# EAGLE design chibarobo2024 (EAGLE 9.6.2)

## Sheet 1 of 2
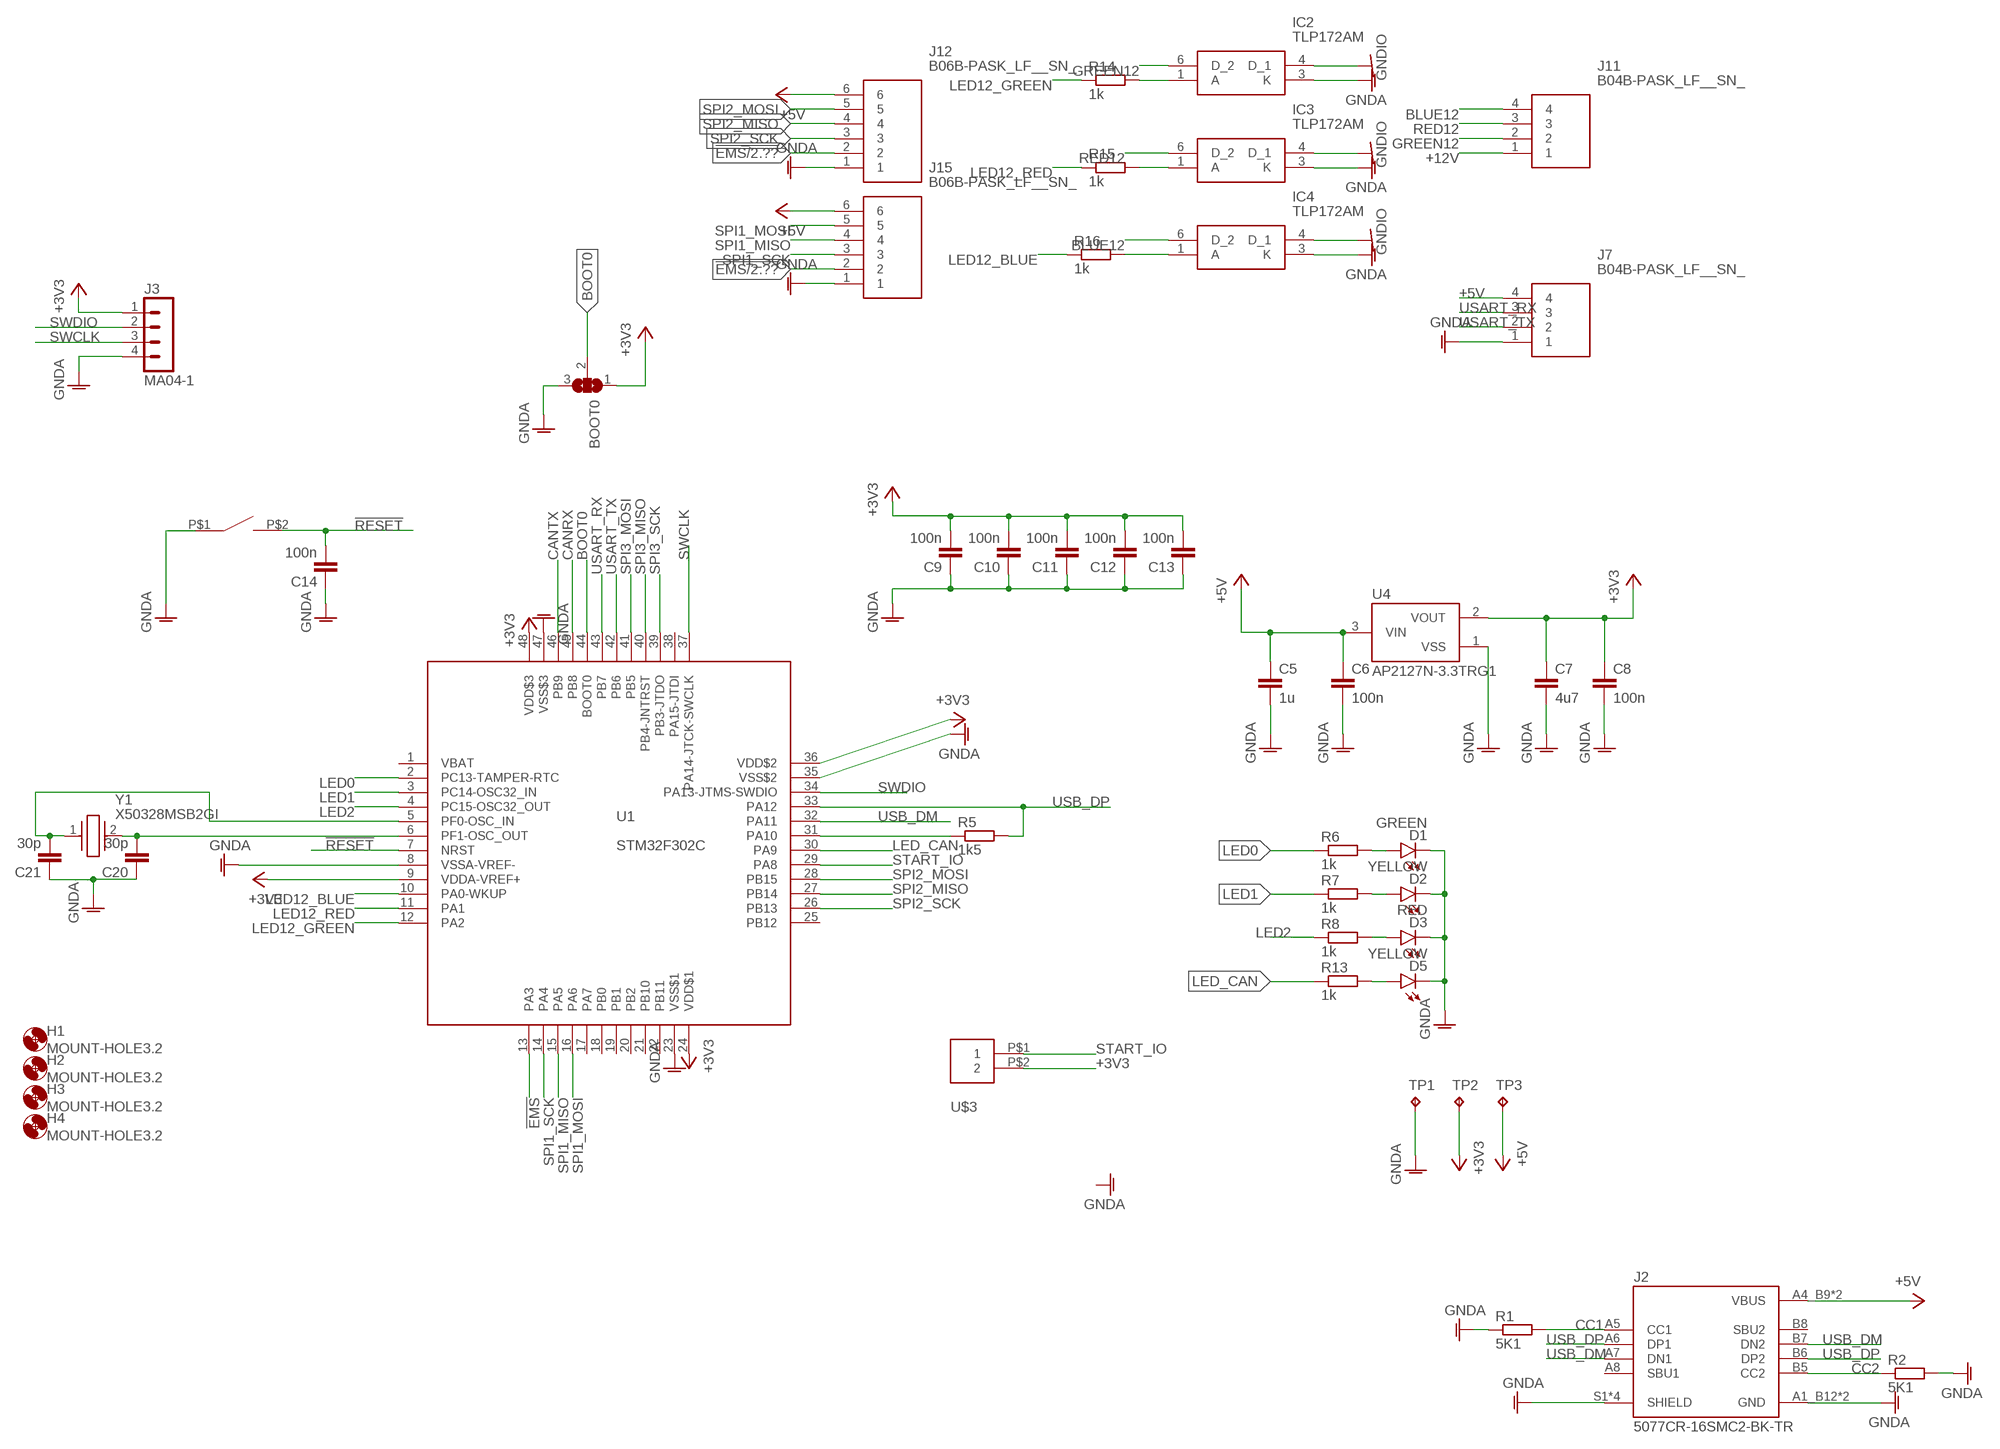
[diagram p0: schematic, sheet 1]

### Parts
BOOT0  SJ2W  [SJ_2]
C5  1u  C-EUC0603  [C0603]
C6  100n  C-EUC0603  [C0603]
C7  4u7  C-EUC0805  [C0805]
C8  100n  C-EUC0603  [C0603]
C9  100n  C-EUC0603  [C0603]
C10  100n  C-EUC0603  [C0603]
C11  100n  C-EUC0603  [C0603]
C12  100n  C-EUC0603  [C0603]
C13  100n  C-EUC0603  [C0603]
C14  100n  C-EUC0603  [C0603]
C20  30p  C-EUC0603  [C0603]
C21  30p  C-EUC0603  [C0603]
D1  GREEN  LEDCHIPLED_0805  [CHIPLED_0805]
D2  YELLOW  LEDCHIPLED_0805  [CHIPLED_0805]
D3  RED  LEDCHIPLED_0805  [CHIPLED_0805]
D5  YELLOW  LEDCHIPLED_0805  [CHIPLED_0805]
H1  MOUNT-HOLE3.2  [3,2]
H2  MOUNT-HOLE3.2  [3,2]
H3  MOUNT-HOLE3.2  [3,2]
H4  MOUNT-HOLE3.2  [3,2]
IC2  TLP172AM  [11-4M1S]
IC3  TLP172AM  [11-4M1S]
IC4  TLP172AM  [11-4M1S]
J2  5077CR-16SMC2-BK-TR  [NELTRON_5077CR-16SMC2-BK-TR]
J3  MA04-1  [MA04-1]
J7  B04B-PASK_LF__SN_  [B04BPASKLFSN]
J11  B04B-PASK_LF__SN_  [B04BPASKLFSN]
J12  B06B-PASK_LF__SN_  [B06BPASKLFSN]
J15  B06B-PASK_LF__SN_  [B06BPASKLFSN]
R1  5K1  R-EU_R0603  [R0603]
R2  5K1  R-EU_R0603  [R0603]
R5  1k5  R-EU_R0603  [R0603]
R6  1k  R-EU_R0603  [R0603]
R7  1k  R-EU_R0603  [R0603]
R8  1k  R-EU_R0603  [R0603]
R13  1k  R-EU_R0603  [R0603]
R14  1k  R-EU_R0603  [R0603]
R15  1k  R-EU_R0603  [R0603]
R16  1k  R-EU_R0603  [R0603]
S1  SWITCH_TACTILETOP  [SWITCH_TACTILE_3X6]
TP1  TPB1,27  [B1,27]
TP2  TPB1,27  [B1,27]
TP3  TPB1,27  [B1,27]
U1  STM32F302C  STM32F303C  [LQFP48]
U4  AP2127N-3.3TRG1  XC6206  [SOT95P240X110-3]
U$3  XH-2-STRAIGHT  [CON-XH-2-STRAIGHT]
Y1  X50328MSB2GI  [RESC5032X135N]

### Nets
!EMS: J12.2 J15.2 U1.13(PA3) ; also sheet 2
!RESET: C14.2 S1.P$2 U1.7(NRST)
+3V3: BOOT0.1 C7.1 C8.1 C9.2 C10.2 C11.2 C12.2 C13.2 J3.1 TP2.TP U1.9(VDDA-VREF+) U1.24(VDD$1) U1.36(VDD$2) U1.48(VDD$3) U4.2(VOUT) U$3.P$2 ; also sheet 2
+5V [0.5mm]: C5.1 C6.1 J2.A4_B9(VBUS) J2.B4_A9(VBUS) J7.4 J12.6 J15.6 TP3.TP U4.3(VIN) ; also sheet 2
+12V [1mm]: J11.1 ; also sheet 2
BLUE12 [0.5mm]: IC4.6(D_2) J11.4
BOOT0: BOOT0.2 U1.44(BOOT0)
CANRX: U1.45(PB8) ; also sheet 2
CANTX: U1.46(PB9) ; also sheet 2
CC1: J2.A5(CC1) R1.2
CC2: J2.B5(CC2) R2.1
GNDA: BOOT0.3 C5.2 C6.2 C7.2 C8.2 C9.1 C10.1 C11.1 C12.1 C13.1 C14.1 C20.1 C21.1 D1.C D2.C D3.C D5.C IC2.3(K) IC3.3(K) IC4.3(K) J2.A1_B12(GND) J2.B1_A12(GND) J2.S1(SHIELD) J2.S2(SHIELD) J2.S3(SHIELD) J2.S4(SHIELD) J3.4 J7.1 J12.1 J15.1 R1.1 R2.2 S1.P$1 TP1.TP U1.8(VSSA-VREF-) U1.23(VSS$1) U1.35(VSS$2) U1.47(VSS$3) U4.1(VSS) ; also sheet 2
GNDIO: IC2.4(D_1) IC3.4(D_1) IC4.4(D_1) ; also sheet 2
GREEN12 [0.5mm]: IC2.6(D_2) J11.2
LED0: R6.1 U1.2(PC13-TAMPER-RTC)
LED1: R7.1 U1.3(PC14-OSC32_IN)
LED2: R8.1 U1.4(PC15-OSC32_OUT)
LED12_BLUE: R16.1 U1.10(PA0-WKUP)
LED12_GREEN: R14.1 U1.12(PA2)
LED12_RED: R15.1 U1.11(PA1)
LED_CAN: R13.1 U1.30(PA9)
N$2: D2.A R7.2
N$5: D1.A R6.2
N$7: C20.2 U1.6(PF1-OSC_OUT) Y1.2
N$8: C21.2 U1.5(PF0-OSC_IN) Y1.1
N$11: R5.1 U1.31(PA10)
N$12: D5.A R13.2
N$14: IC2.1(A) R14.2
N$15: IC3.1(A) R15.2
N$18: IC4.1(A) R16.2
N$21: D3.A R8.2
RED12 [0.5mm]: IC3.6(D_2) J11.3
SPI1_MISO: J15.4 U1.15(PA5)
SPI1_MOSI: J15.5 U1.16(PA6)
SPI1_SCK: J15.3 U1.14(PA4)
SPI2_MISO: J12.4 U1.27(PB14)
SPI2_MOSI: J12.5 U1.28(PB15)
SPI2_SCK: J12.3 U1.26(PB13)
SPI3_MISO: U1.40(PB4-JNTRST)
SPI3_MOSI: U1.41(PB5)
SPI3_SCK: U1.39(PB3-JTDO)
START_IO: U1.29(PA8) U$3.P$1
SWCLK: J3.3 U1.37(PA14-JTCK-SWCLK)
SWDIO: J3.2 U1.34(PA13-JTMS-SWDIO)
USART_RX: J7.3 U1.43(PB7)
USART_TX: J7.2 U1.42(PB6)
USB_DM: J2.A7(DN1) J2.B7(DN2) U1.32(PA11)
USB_DP: J2.A6(DP1) J2.B6(DP2) R5.2 U1.33(PA12)
Unconnected: J2.A8(SBU1) J2.B8(SBU2) U1.1(VBAT) U1.17(PA7) U1.18(PB0) U1.19(PB1) U1.20(PB2) U1.21(PB10) U1.22(PB11) U1.25(PB12) U1.38(PA15-JTDI)

## Sheet 2 of 2
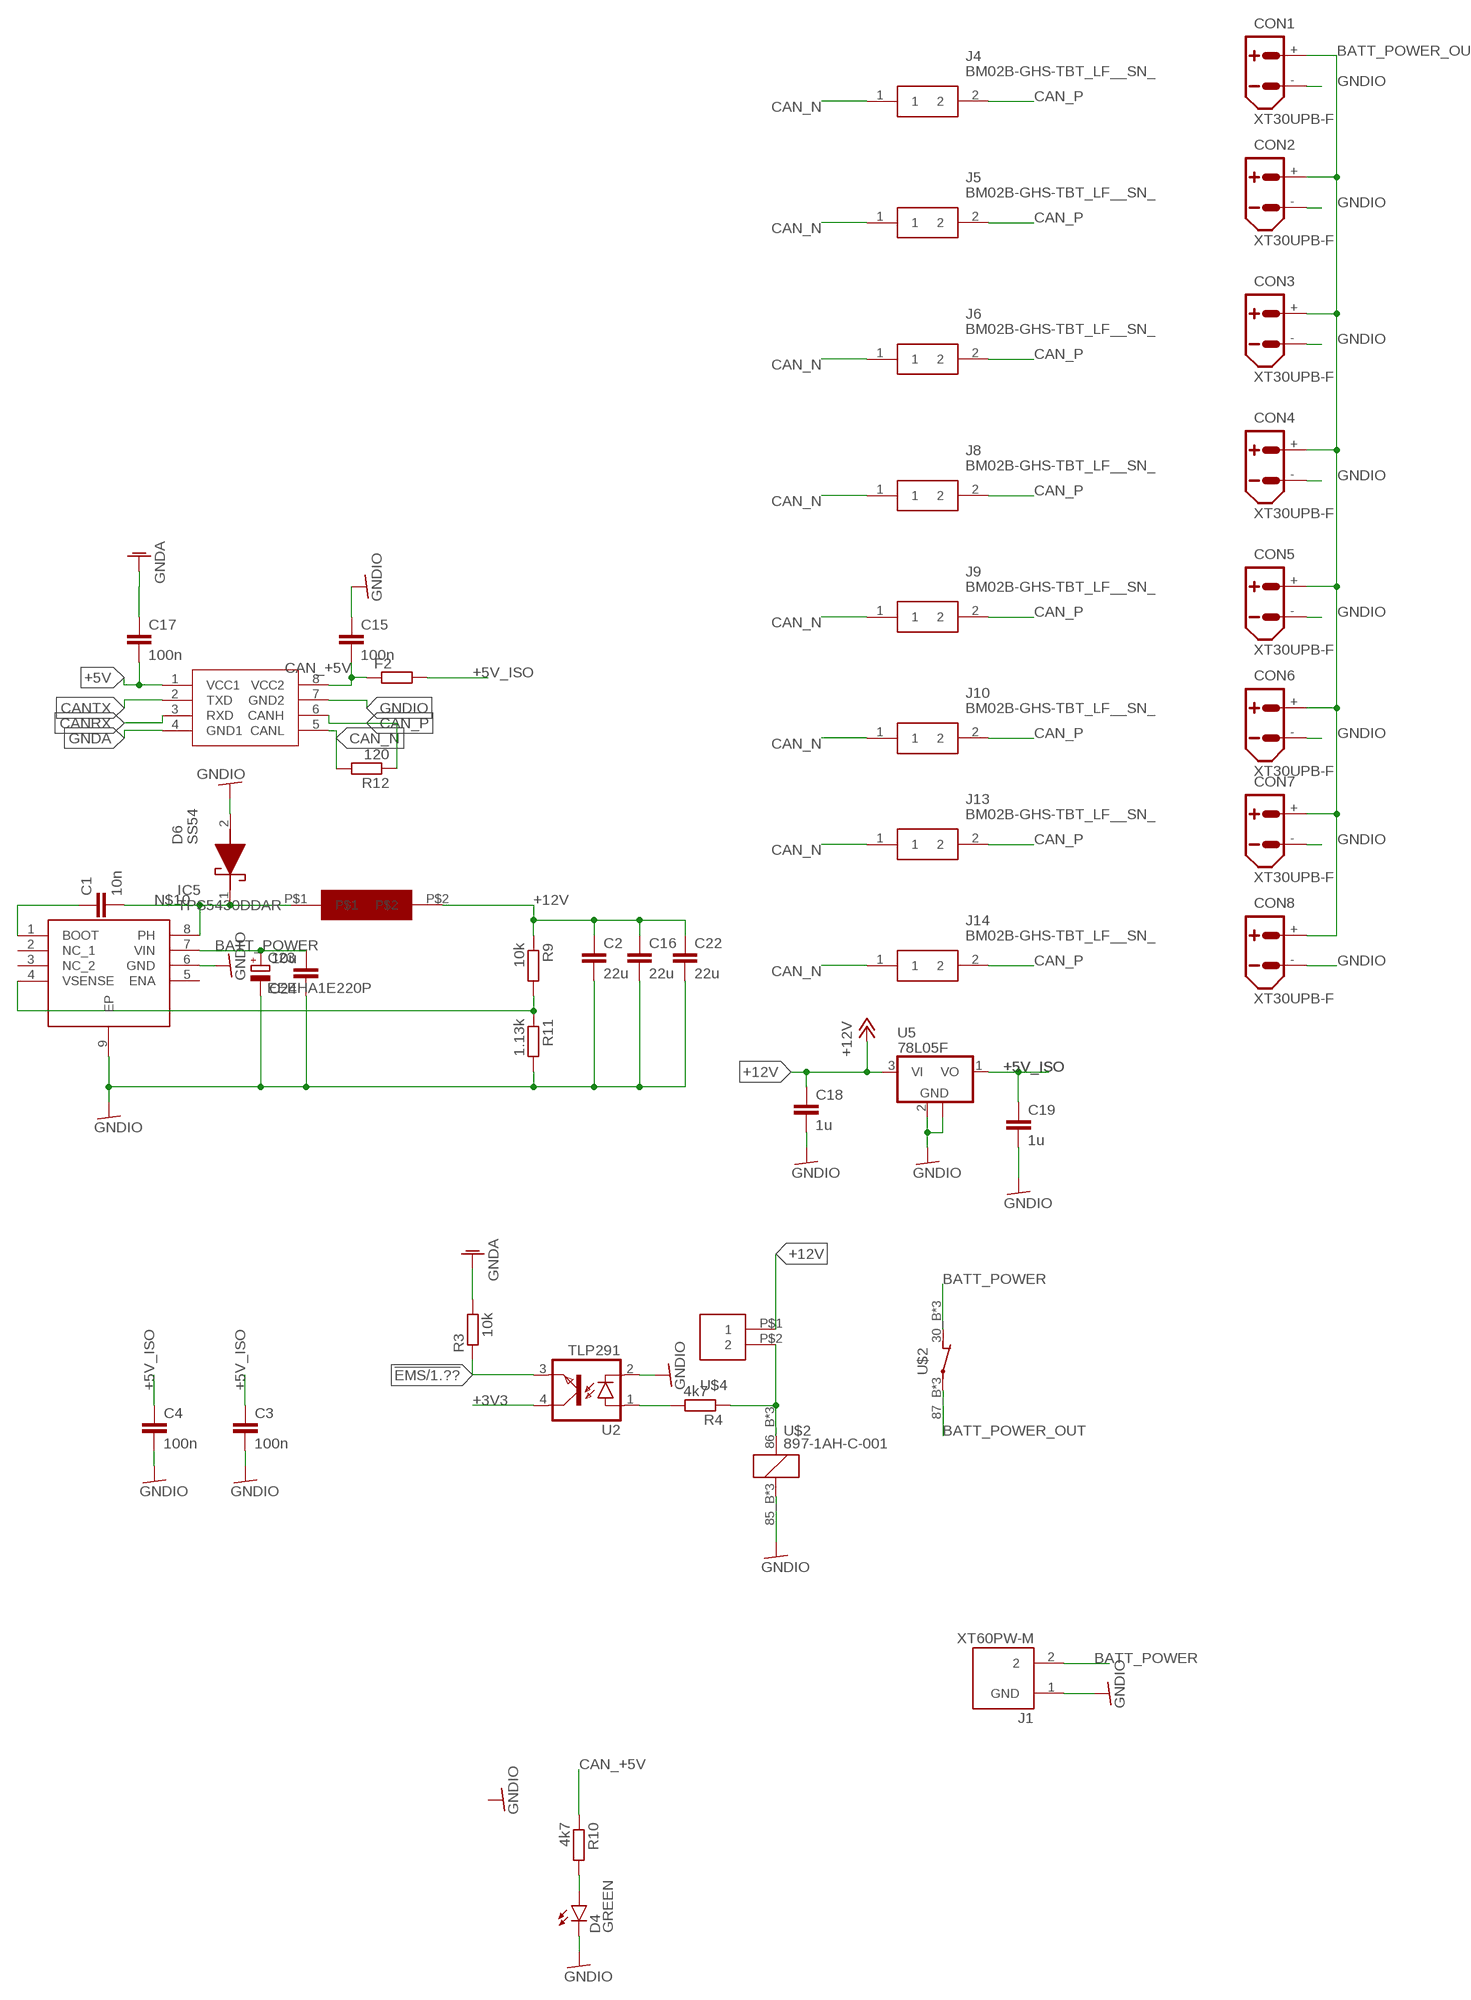
[diagram p1: schematic, sheet 2]

### Parts
C1  10n  C-EUC0603  [C0603]
C2  22u  C-EUC0805  [C0805]
C3  100n  C-EUC0603  [C0603]
C4  100n  C-EUC0603  [C0603]
C15  100n  C-EUC0603  [C0603]
C16  22u  C-EUC0805  [C0805]
C17  100n  C-EUC0603  [C0603]
C18  1u  C-EUC0603  [C0603]
C19  1u  C-EUC0603  [C0603]
C22  22u  C-EUC0805  [C0805]
C23  EEEHA1E220P  CPOL-EU153CLV-0605  [153CLV-0605]
C24  10u  C-EUC1210  [C1210]
CON1  XT30UPB-F  [XT30UPB-F]
CON2  XT30UPB-F  [XT30UPB-F]
CON3  XT30UPB-F  [XT30UPB-F]
CON4  XT30UPB-F  [XT30UPB-F]
CON5  XT30UPB-F  [XT30UPB-F]
CON6  XT30UPB-F  [XT30UPB-F]
CON7  XT30UPB-F  [XT30UPB-F]
CON8  XT30UPB-F  [XT30UPB-F]
D4  GREEN  LEDCHIPLED_0805  [CHIPLED_0805]
D6  SS54  [DIOM5126X245N]
F2  R-EU_R1206  [R1206]
IC5  TPS5430DDAR  [SOIC127P600X170-9N]
J1  XT60PW-M  [AMASS_XT60PW-M]
J4  BM02B-GHS-TBT_LF__SN_  [BM02B-GHS-TBT_1]
J5  BM02B-GHS-TBT_LF__SN_  [BM02B-GHS-TBT_1]
J6  BM02B-GHS-TBT_LF__SN_  [BM02B-GHS-TBT_1]
J8  BM02B-GHS-TBT_LF__SN_  [BM02B-GHS-TBT_1]
J9  BM02B-GHS-TBT_LF__SN_  [BM02B-GHS-TBT_1]
J10  BM02B-GHS-TBT_LF__SN_  [BM02B-GHS-TBT_1]
J13  BM02B-GHS-TBT_LF__SN_  [BM02B-GHS-TBT_1]
J14  BM02B-GHS-TBT_LF__SN_  [BM02B-GHS-TBT_1]
R3  10k  R-EU_R0603  [R0603]
R4  4k7  R-EU_R0603  [R0603]
R9  10k  R-EU_R0603  [R0603]
R10  4k7  R-EU_R0603  [R0603]
R11  1.13k  R-EU_R0603  [R0603]
R12  120  R-EU_R0603  [R0603]
U2  TLP291  [MINI-FLAT-4]
U5  78L05F  [SOT89]
U$1  CA-IS1044S  [SOIC8]
U$2  897-1AH-C-001  [897-1AH-C-001]
U$4  XH-2-STRAIGHT  [CON-XH-2-STRAIGHT]
U$5  INDUCTOR125_125  [INDUCTOR125_125]

### Nets
!EMS: R3.1 U2.3(EMIT) ; also sheet 1
+3V3: U2.4(COL) ; also sheet 1
+5V [0.5mm]: C17.2 U$1.1(VCC1) ; also sheet 1
+5V_ISO [0.5mm]: C3.1 C4.1 C19.1 F2.2 U5.1(VO)
+12V [1mm]: C2.1 C16.1 C18.1 C22.1 R9.1 U5.3(VI) U$4.P$1 U$5.P$2 ; also sheet 1
BATT_POWER [0.5mm]: C23.+ C24.2 IC5.7(VIN) J1.2 U$2.30_B(O) U$2.30_T(O) U$2.P$3(O)
BATT_POWER_OUT: CON1.+ CON2.+ CON3.+ CON4.+ CON5.+ CON6.+ CON7.+ CON8.+ U$2.87_B(P) U$2.87_T(P) U$2.P$1(P)
CAN_+5V: C15.2 F2.1 R10.1 U$1.8(VCC2)
CAN_N: J4.1 J5.1 J6.1 J8.1 J9.1 J10.1 J13.1 J14.1 R12.2 U$1.5(CANL)
CAN_P: J4.2 J5.2 J6.2 J8.2 J9.2 J10.2 J13.2 J14.2 R12.1 U$1.6(CANH)
CANRX: U$1.3(RXD) ; also sheet 1
CANTX: U$1.2(TXD) ; also sheet 1
GNDA: C17.1 R3.2 U$1.4(GND1) ; also sheet 1
GNDIO: C2.2 C3.2 C4.2 C15.1 C16.2 C18.2 C19.2 C22.2 C23.- C24.1 CON1.- CON2.- CON3.- CON4.- CON5.- CON6.- CON7.- CON8.- D4.C D6.2(A) IC5.6(GND) IC5.9(EP) J1.1(GND) R11.2 U2.2(C) U5.2(GND) U5.2@1(GND) U$1.7(GND2) U$2.85_B U$2.85_T U$2.P$2 ; also sheet 1
N$1: R4.1 U$2.86_B U$2.86_T U$2.P$4 U$4.P$2
N$3: R4.2 U2.1(A)
N$4: IC5.4(VSENSE) R9.2 R11.1
N$6: C1.1 IC5.1(BOOT)
N$9: D4.A R10.2
N$10 [1mm]: C1.2 D6.1(K) IC5.8(PH) U$5.P$1
Unconnected: IC5.2(NC_1) IC5.3(NC_2) IC5.5(ENA)

## Library data of the parts
BOOT0 = jumper:SJ2W: SMD solder JUMPER
C1-C4 C15-C17 C22 C24 = rcl:C-EU: CAPACITOR, European symbol; SPICEPREFIX: C
C5-C14 C18-C21 = rcl:C-EU: CAPACITOR, European symbol
C23 = rcl:CPOL-EU: POLARIZED CAPACITOR, European symbol; SPICEPREFIX: C
CON1-CON8 = amass:XT30: AMASS XT30 connector Store in Japan AMASS XT30 connector
D1-D5 = led:LED: LED OSRAM: - CHIPLED LG R971, LG N971, LY N971, LG Q971, LY Q971, LO R971, LY R971 LH N974, LH R974 LS Q976, LO Q976, LY Q976 LO Q996 - Hyper CHIPLED LW Q18S LB Q993, LB Q99A, LB R99A - SideLED LS A670, LO A670, LY A670, LG A670, LP A670 LB A673, LV A673, LT A673, LW A673 LH A674 LY A675 LS A676, LA A676, LO A676, LY A676, LW A676 LS A679, LY A679, LG A679 - Hyper Micro SIDELED® LS Y876, LA Y876, LO Y876, LY Y876 LT Y87S - SmartLED LW L88C, LW L88S LB L89C, LB L89S, LG L890 LS L89K, LO L89K, LY L89K LS L896, LA L896, LO L896, LY L896 - TOPLED LS T670, LO T670, LY T670, LG T670, LP T670 LSG T670, LSP T670, LSY T670, LOP T670, LYG T670 LG T671, LOG T671, LSG T671 LB T673, LV T673, LT T673, LW T673 LH T674 LS T676, LA T676, LO T676, LY T676, LB T676, LH T676, LSB T676, LW T676 LB T67C, LV T67C, LT T67C, LS T67K, LO T67K, LY T67K, LW E67C LS E67B, LA E67B, LO E67B, LY E67B, LB E67C, LV E67C, LT E67C LW T67C LS T679, LY T679, LG T679 LS T770, LO T770, LY T770, LG T770, LP T770 LB T773, LV T773, LT T773, LW T773 LH T774 LS E675, LA E675, LY E675, LS T675 LS T776, LA T776, LO T776, LY T776, LB T776 LHGB T686 LT T68C, LB T68C - Hyper Mini TOPLED® LB M676 - Mini TOPLED Santana® LG M470 LS M47K, LO M47K, LY M47K Source: http://www.osram.convergy.de LUXEON: - LUMILED® LXK2-PW12-R00, LXK2-PW12-S00, LXK2-PW14-U00, LXK2-PW14-V00 LXK2-PM12-R00, LXK2-PM12-S00, LXK2-PM14-U00 LXK2-PE12-Q00, LXK2-PE12-R00, LXK2-PE12-S00, LXK2-PE14-T00, LXK2-PE14-U00 LXK2-PB12-K00, LXK2-PB12-L00, LXK2-PB12-M00, LXK2-PB14-N00, LXK2-PB14-P00, LXK2-PB14-Q00 LXK2-PR12-L00, LXK2-PR12-M00, LXK2-PR14-Q00, LXK2-PR14-R00 LXK2-PD12-Q00, LXK2-PD12-R00, LXK2-PD12-S00 LXK2-PH12-R00, LXK2-PH12-S00 LXK2-PL12-P00, LXK2-PL12-Q00, LXK2-PL12-R00 Source: www.luxeon.com KINGBRIGHT: KA-3528ASYC Source: www.kingbright.com
D6 = SS54:SS54: 40V 550mV@5A 5A SMA(DO-214AC) Schottky Barrier Diodes (SBD) Source: Datasheet; DESCRIPTION: 40V 550mV@5A 5A SMA(DO-214AC) Schottky Barrier Diodes (SBD); HEIGHT: 2.45mm; MANUFACTURER_NAME: LGE; MANUFACTURER_PART_NUMBER: SS54
F2 R1-R16 = rcl:R-EU_: RESISTOR, European symbol; SPICEPREFIX: R
H1-H4 = holes:MOUNT-HOLE: MOUNTING HOLE with drill center marker
IC2-IC4 = TLP172AM:TLP172AM: 1a, 60 V/0.5 A Photorelay, 3750 Vrms, 4pin SO6 Source: Datasheet; DESCRIPTION: 1a, 60 V/0.5 A Photorelay, 3750 Vrms, 4pin SO6; HEIGHT: mm; MANUFACTURER_NAME: Toshiba; MANUFACTURER_PART_NUMBER: TLP172AM; MOUSER_PART_NUMBER: N/A; MOUSER_PRICE-STOCK: https://www.mouser.co.uk/ProductDetail/Toshiba/TLP172AM?qs=By6Nw2ByBD3vUbhgS14Aeg%3D%3D
IC5 = TPS5430DDAR:TPS5430DDAR: Texas Instruments, TPS5430DDAR Step-Down Switching Regulator 3A Adjustable, 1.22 31 V, 8-Pin SOIC Source: Datasheet; ARROW_PART_NUMBER: TPS5430DDAR; ARROW_PRICE-STOCK: https://www.arrow.com/en/products/tps5430ddar/texas-instruments?region=nac; DESCRIPTION: Texas Instruments, TPS5430DDAR Step-Down Switching Regulator 3A Adjustable, 1.22 31 V, 8-Pin SOIC; HEIGHT: 1.7mm; MANUFACTURER_NAME: Texas Instruments; MANUFACTURER_PART_NUMBER: TPS5430DDAR
J1 = con-xt:XT60PW-M; AVAILABILITY: Unavailable; MF: AMASS; MP: XT60PW-M; PACKAGE: Package Analog Devices; PRICE: None
J2 = 5077CR-16SMC2-BK-TR:5077CR-16SMC2-BK-TR: Check availability; AVAILABILITY: Not in stock; CHECK_PRICES: https://www.snapeda.com/parts/5077CR-16SMC2-BK-TR/Neltron/view-part/?ref=eda; DESCRIPTION: USB 3.1 C Type Female with Peg; MF: Neltron; MP: 5077CR-16SMC2-BK-TR; PACKAGE: Package; PRICE: None; SNAPEDA_LINK: https://www.snapeda.com/parts/5077CR-16SMC2-BK-TR/Neltron/view-part/?ref=snap
J3 = con-headers:MA04-1
J4-J6 J8-J10 J13 J14 = BM02B-GHS-TBT_LF__SN_:BM02B-GHS-TBT_LF__SN_: GH 1.25mm header top entry 2 way JST GH Series, 1.25mm Pitch 2 Way Shrouded Straight PCB Header, Surface Mount, Solder Termination Source: Datasheet; DESCRIPTION: GH 1.25mm header top entry 2 way JST GH Series, 1.25mm Pitch 2 Way Shrouded Straight PCB Header, Surface Mount, Solder Termination; HEIGHT: mm; MANUFACTURER_NAME: JST (JAPAN SOLDERLESS TERMINALS); MANUFACTURER_PART_NUMBER: BM02B-GHS-TBT(LF)(SN)
J7 J11 = B04B-PASK_LF__SN_:B04B-PASK_LF__SN_: CONN HEADER VERT 4POS 2MM Source: Datasheet; ARROW_PART_NUMBER: B04B-PASK(LF)(SN); ARROW_PRICE-STOCK: https://www.arrow.com/en/products/b04b-pask-lf-sn/jst-manufacturing?utm_currency=USD&region=europe; DESCRIPTION: CONN HEADER VERT 4POS 2MM; HEIGHT: 7.7mm; MANUFACTURER_NAME: JST (JAPAN SOLDERLESS TERMINALS); MANUFACTURER_PART_NUMBER: B04B-PASK(LF)(SN)
J12 J15 = B06B-PASK_LF__SN_:B06B-PASK_LF__SN_: CONN HEADER VERT 6POS 2MM Source: Datasheet; ARROW_PART_NUMBER: B06B-PASK(LF)(SN); ARROW_PRICE-STOCK: https://www.arrow.com/en/products/b06b-pask-lf-sn/jst-manufacturing?region=europe; DESCRIPTION: CONN HEADER VERT 6POS 2MM; HEIGHT: 7.7mm; MANUFACTURER_NAME: JST (JAPAN SOLDERLESS TERMINALS); MANUFACTURER_PART_NUMBER: B06B-PASK(LF)(SN); MOUSER_PART_NUMBER: 306-B06BPASKLFSN; MOUSER_PRICE-STOCK: https://www.mouser.co.uk/ProductDetail/JST-Commercial/B06B-PASKLFSN?qs=QpmGXVUTftEdynavz55pQw%3D%3D
S1 = switch-tactile:SWITCH_TACTILE
TP1-TP3 = testpad:TP: Test pad
U1 = stm32_mcu:STM32F303C*
U2 = toshiba:TLP291: TOSHIBA PHOTOCOUPLER GaAs IRED & PHOTO-TRANSISTOR; OC_FARNELL: unknown; OC_NEWARK: unknown
U4 = torex:XC6206
U5 = linear:78L*: POSITOIV-VOLTAGE REGULATORS Output up to 100 mA Source: Datasheet
U$1 = CRS_EAGLE_Lib:CA-IS1044S
U$2 = CRS_EAGLE_Lib:897-1AH-C-001
U$3 U$4 = con-xh:XH-2-STRAIGHT
U$5 = CRS_EAGLE_Lib:INDUCTOR125_125
Y1 = X50328MSB2GI:X50328MSB2GI: SMD Crystal Resonators 8MHz +/-10ppm SMD-5032_2P RoHS Source: Datasheet; DESCRIPTION: SMD Crystal Resonators 8MHz +/-10ppm SMD-5032_2P RoHS; HEIGHT: 1.35mm; MANUFACTURER_NAME: Yangxing Tech; MANUFACTURER_PART_NUMBER: X50328MSB2GI

## Net classes
1 1mm: width 1 mm
2 0.5mm: width 0.5 mm

## Board
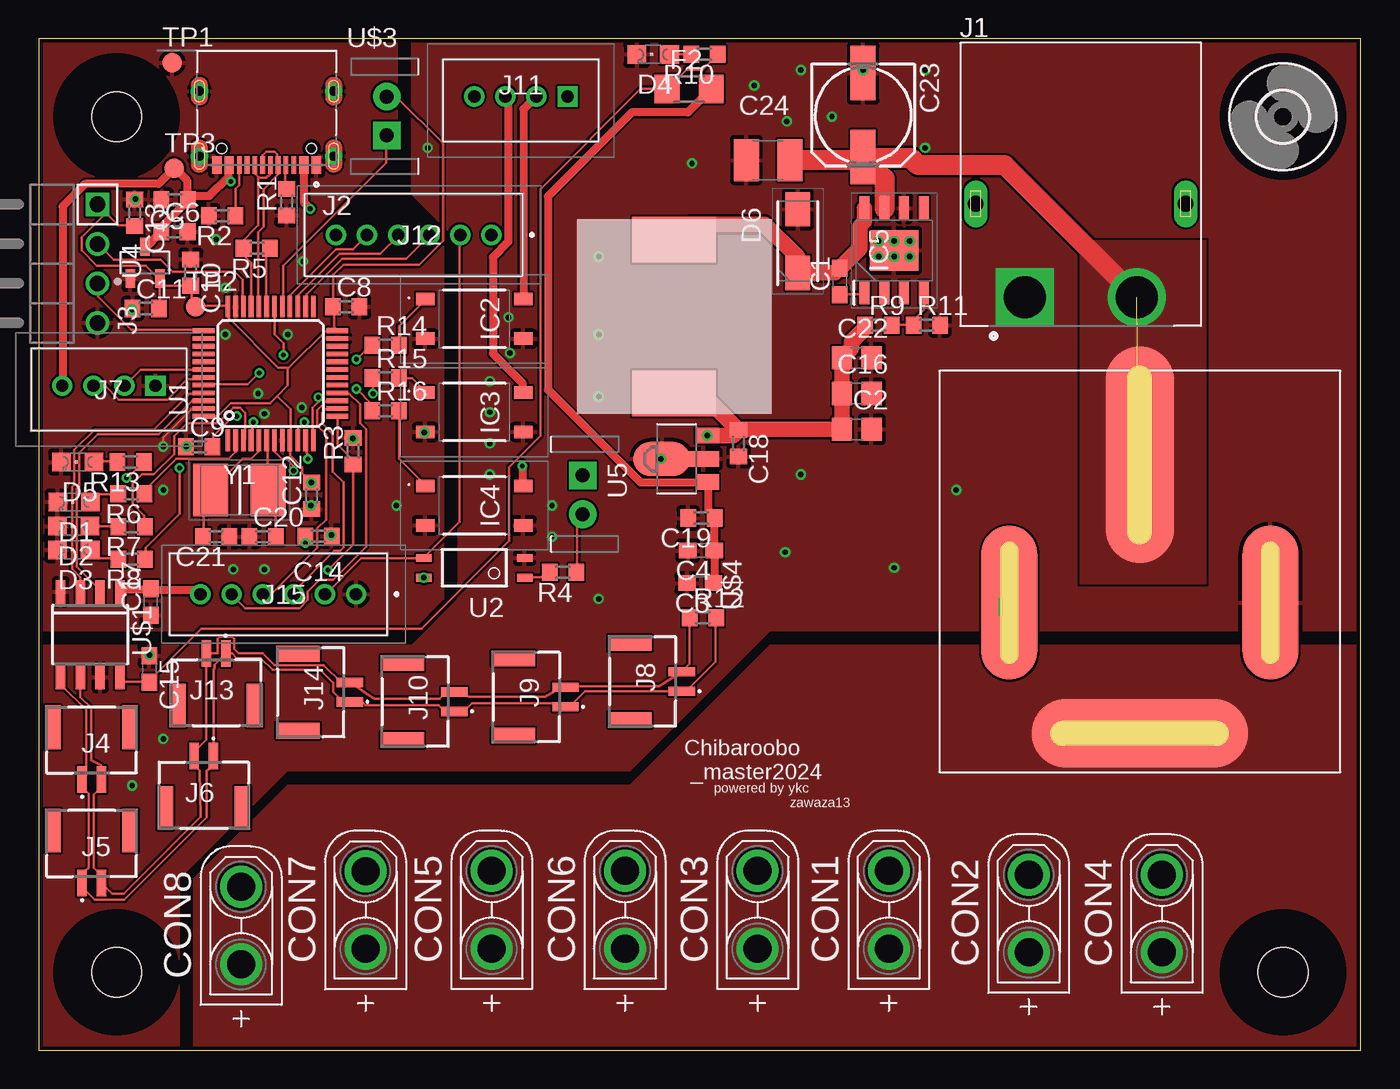
[diagram p2: board, top side]
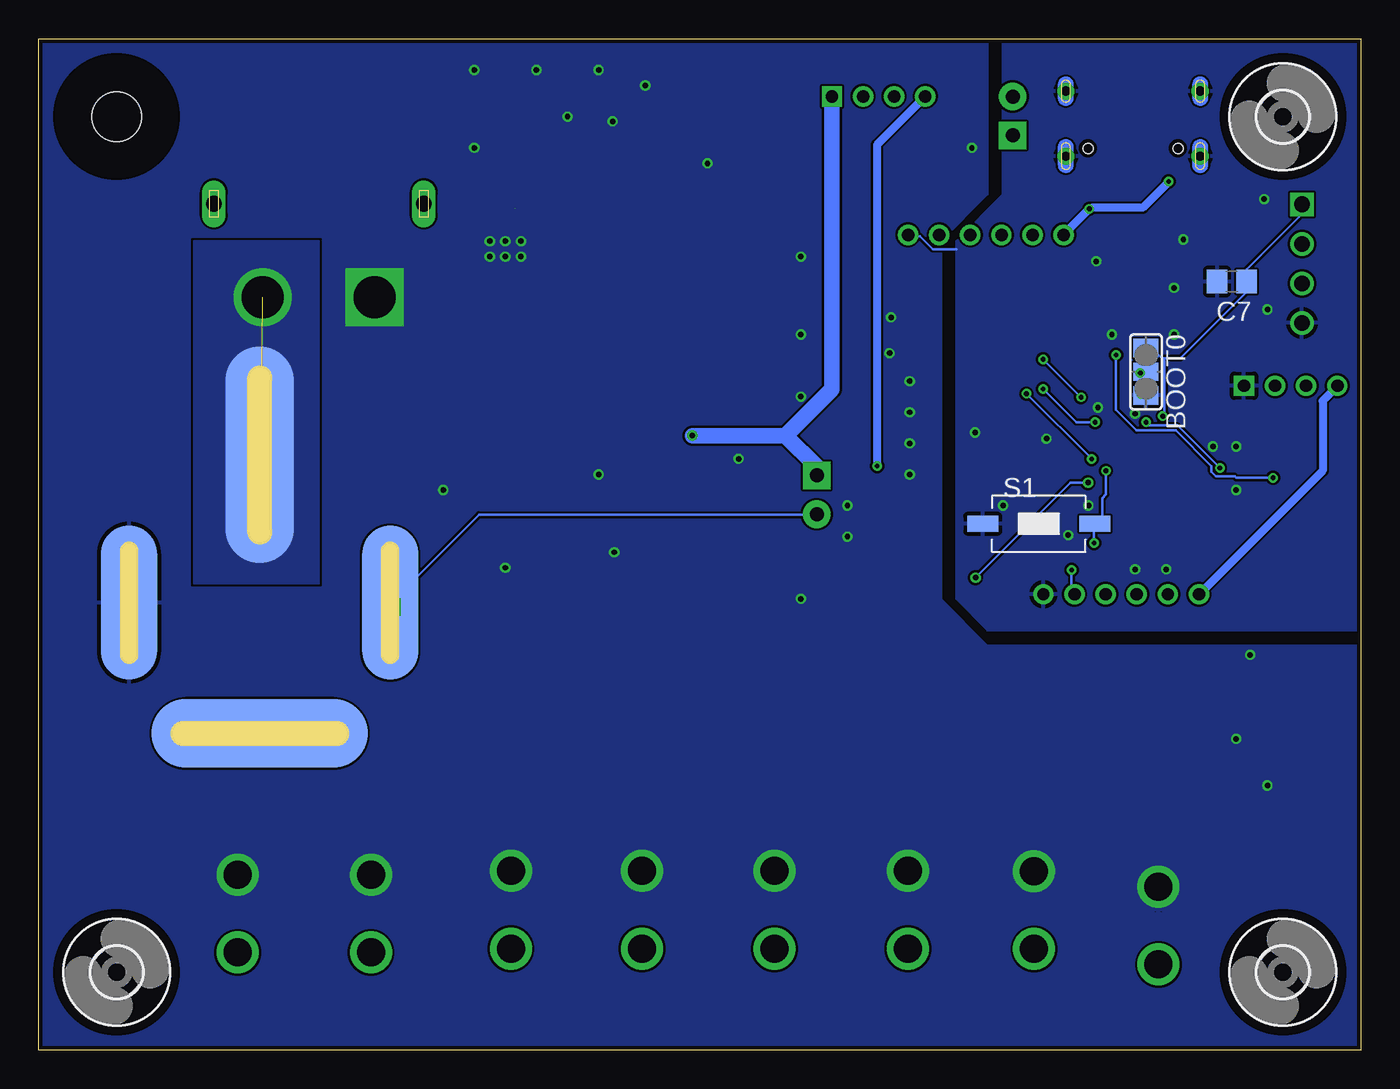
[diagram p3: board, bottom side, seen from below]

Size 85 x 65 mm. Coordinates in mm from the lower left corner, seen from the top.
Outline: 0,0 85,0 85,65 0,65 0,0
Copper layers (1*16): Top 0.035mm / dielectric 1.5mm / Bottom 0.035mm
Design rules "SeeedStudio_2layer_DRU_no_angle_20140221": minimum track width 6mil, minimum drill 12mil, track to track 6mil, track to pad 6mil, pad to pad 6mil, via to via 6mil, smd to smd 0mil, copper to edge 10mil, drill to drill 10mil, minimum pad ring 10mil, minimum via ring 6mil, stop-mask expansion 2mil, vias tented up to drill 100mil, thermal gap 10mil

### Footprints (pad centres in the part's own frame; a part is rotated, then mirrored left to right if it is on the bottom)
SJ_2 = smd 1.168 x 1.6: 1 -1.524,0; 2 0,0; 3 1.524,0
C0603 = smd 1.1 x 1: 1 -0.85,0; 2 0.85,0
C0805 = smd 1.3 x 1.5: 1 -0.95,0; 2 0.95,0
C0603' = smd 1 x 1.1: 1 -0.85,0; 2 0.85,0
153CLV-0605 = smd 3.5 x 1.6: + 2.7,0; - -2.7,0
C1210 = smd 1.6 x 2.7: 1 -1.4,0; 2 1.4,0
XT30UPB-F = drill 1.8: + 2.5,0; - -2.5,0
CHIPLED_0805 = smd 1.2 x 1.2: A 0,-1.05; C 0,1.05
DIOM5126X245N = smd 2.2 x 1.55: 1 -2.05,0; 2 2.05,0
R1206 = smd 1.6 x 1.803: 1 -1.422,0; 2 1.422,0
3,2 = hole 3.2: 0,0
11-4M1S = smd 0.8 x 1.2: 1 -1.27,-3.15; 3 1.27,-3.15; 4 1.27,3.15; 6 -1.27,3.15
SOIC127P600X170-9N = smd 1.525 x 0.65: 1 -2.712,1.905; 2 -2.712,0.635; 3 -2.712,-0.635; 4 -2.712,-1.905; 5 2.712,-1.905; 6 2.712,-0.635; 7 2.712,0.635; 8 2.712,1.905 | smd 2.6 x 3.1: 9 0,0
AMASS_XT60PW-M = drill 2.7 square: 1 -3.6,-6 | drill 2.7: 2 3.6,-6 | drill 1 pad 1.2 long: S1 -6.75,0; S2 6.75,0
NELTRON_5077CR-16SMC2-BK-TR = smd 0.6 x 1.15: A1_B12 -3.2,1.065; A4_B9 -2.4,1.065; B1_A12 3.2,1.065; B4_A9 2.4,1.065 | smd 0.3 x 1.15: A5 -1.25,1.065; A6 -0.25,1.065; A7 0.25,1.065; A8 1.25,1.065; B5 1.75,1.065; B6 0.75,1.065; B7 -0.75,1.065; B8 -1.75,1.065 | drill 0.6 pad 1: S1 -4.32,-3.68; S2 4.32,-3.68; S3 -4.32,0.5; S4 4.32,0.5 | hole 0.65: -2.89,0; 2.89,0
MA04-1 = drill 1.016 square: 1 3.81,0 | drill 1.016: 2 1.27,0; 3 -1.27,0; 4 -3.81,0
BM02B-GHS-TBT_1 = smd 0.6 x 1.7: 1 0.625,0; 2 -0.625,0 | smd 1 x 2.8: 3 -2.475,-3.35; 4 2.475,-3.35
B04BPASKLFSN = drill 0.8 pad 1.3 square: 1 0,0 | drill 0.8 pad 1.3: 2 -2,0; 3 -4,0; 4 -6,0
B06BPASKLFSN = drill 0.8 pad 1.3: 1 0,0; 2 -2,0; 3 -4,0; 4 -6,0; 5 -8,0; 6 -10,0
R0603 = smd 1 x 1.1: 1 -0.85,0; 2 0.85,0
SWITCH_TACTILE_3X6 = smd 2 x 1: P$1 -3.6,0; P$2 3.6,0
B1,27 = smd 1.27 x 1.27: TP 0,0
LQFP48 = smd 1.4 x 0.3: 1 -4.3,2.75; 2 -4.3,2.25; 3 -4.3,1.75; 4 -4.3,1.25; 5 -4.3,0.75; 6 -4.3,0.25; 7 -4.3,-0.25; 8 -4.3,-0.75; 9 -4.3,-1.25; 10 -4.3,-1.75; 11 -4.3,-2.25; 12 -4.3,-2.75; 25 4.3,-2.75; 26 4.3,-2.25; 27 4.3,-1.75; 28 4.3,-1.25; 29 4.3,-0.75; 30 4.3,-0.25; 31 4.3,0.25; 32 4.3,0.75; 33 4.3,1.25; 34 4.3,1.75; 35 4.3,2.25; 36 4.3,2.75 | smd 0.3 x 1.4: 13 -2.75,-4.3; 14 -2.25,-4.3; 15 -1.75,-4.3; 16 -1.25,-4.3; 17 -0.75,-4.3; 18 -0.25,-4.3; 19 0.25,-4.3; 20 0.75,-4.3; 21 1.25,-4.3; 22 1.75,-4.3; 23 2.25,-4.3; 24 2.75,-4.3; 37 2.75,4.3; 38 2.25,4.3; 39 1.75,4.3; 40 1.25,4.3; 41 0.75,4.3; 42 0.25,4.3; 43 -0.25,4.3; 44 -0.75,4.3; 45 -1.25,4.3; 46 -1.75,4.3; 47 -2.25,4.3; 48 -2.75,4.3
MINI-FLAT-4 = smd 1 x 0.5: 1 -3.24,0.635; 2 -3.24,-0.635; 3 3.24,-0.635; 4 3.24,0.635
SOT95P240X110-3 = smd 1.18 x 0.609: 1 -1.024,0.95; 2 -1.024,-0.95; 3 1.024,0
SOT89 = smd 1 x 1.5: 1 -1.499,-1.981; 3 1.499,-1.981 | smd 1 x 2: 2 0,-1.727 | smd 2.2 x 3.7: 2@1 0,0.94
SOIC8 = smd 0.6 x 1.5: 1 -1.905,-2.75; 2 -0.635,-2.75; 3 0.635,-2.75; 4 1.905,-2.75; 5 1.905,2.75; 6 0.635,2.75; 7 -0.635,2.75; 8 -1.905,2.75
897-1AH-C-001 = smd 4.4 x 13.9 bottom: 30_B 0,-7.5 | smd 4.4 x 13.9: 30_T 0,-7.5 | smd 3.6 x 9.9 bottom: 85_B -8.4,2; 86_B 8.4,2 | smd 3.6 x 9.9: 85_T -8.4,2; 86_T 8.4,2 | smd 13.9 x 4.4 bottom: 87_B 0,10.4 | smd 13.9 x 4.4: 87_T 0,10.4 | drill 0.6 square: P$1 0,10.414; P$2 -8.382,2.286; P$3 0,-7.62; P$4 8.509,2.286
CON-XH-2-STRAIGHT = drill 0.9 pad 1.778 square: P$1 1.21,-0.73 | drill 0.9 pad 1.778: P$2 -1.29,-0.73
INDUCTOR125_125 = smd 5.4 x 2.9: P$1 6.25,1.3; P$2 6.25,11.2
RESC5032X135N = smd 2.25 x 3.4: 1 -1.85,0; 2 1.85,0

### Placement (x,y rotation side)
BOOT0  13.8,43.6 270 bottom
C1  51.5,49.4 90 top
C2  52.6,39.9 0 top
C3  42.53,30.01 180 top
C4  42.58,32.11 180 top
C5  1u  [C0603']  8.74,54.65 180 top
C6  100n  [C0603']  8.72,52.59 0 top
C7  8.28,49.4 180 bottom
C8  100n  [C0603']  19.77,47.79 0 top
C9  100n  [C0603']  10.32,38.79 0 top
C10  100n  [C0603']  9.77,49.98 270 top
C11  100n  [C0603']  6.87,47.67 0 top
C12  100n  [C0603']  17.53,35.62 90 top
C13  100n  [C0603']  6.17,53.83 270 top
C14  100n  [C0603']  17.98,33.03 180 top
C15  7.1,24.5 270 top
C16  52.6,42.2 0 top
C17  7.2,28.8 90 top
C18  1u  [C0603']  45,39 270 top
C19  1u  [C0603']  42.6,34.2 180 top
C20  30p  [C0603']  14.4,33 0 top
C21  30p  [C0603']  11.4,33 180 top
C22  52.6,44.5 0 top
C23  53,60.1 270 top
C24  46.9,57.2 0 top
CON1  54.65,9.01 270 top
CON2  63.65,8.77 270 top
CON3  46.22,9.01 270 top
CON4  72.22,8.77 270 top
CON5  29.12,9.01 270 top
CON6  37.69,9.01 270 top
CON7  21,9 270 top
CON8  13,8 270 top
D1  2.27,35.23 90 top
D2  2.24,33.68 90 top
D3  2.25,32.15 90 top
D4  39.5,64 90 top
D5  2.5,37.8 90 top
D6  48.8,52 90 top
F2  41.82,61.78 0 top
H1  5,60 0 bottom
H2  80,5 0 bottom
H3  5,5 0 bottom
H4  80,60 0 top
IC2  28,47 270 top
IC3  28,41 270 top
IC4  28,35 270 top
IC5  55,51.4 90 top
J1  67,54.4 0 top
J2  14.64,57.96 180 top
J3  3.77,50.55 90 top
J4  3.39,17.4 180 top
J5  3.39,10.75 180 top
J6  10.61,18.9 0 top
J7  7.5,42.7 0 top
J8  41.35,23.69 270 top
J9  33.87,22.69 270 top
J10  26.72,22.39 270 top
J11  34,61.3 0 top
J12  29.1,52.4 0 top
J13  11.4,25.5 0 top
J14  20,23 270 top
J15  20.4,29.3 0 top
R1  15.93,54.5 90 top
R2  11.78,53.63 180 top
R3  20.2,38.5 90 top
R4  33.7,30.7 180 top
R5  14.02,51.53 180 top
R6  5.95,35.75 180 top
R7  5.96,33.65 180 top
R8  5.97,31.55 180 top
R9  54,46.6 0 top
R10  42.8,64 180 top
R11  57.1,46.6 0 top
R12  42.7,27.8 0 top
R13  5.9,37.8 180 top
R14  22.3,45.3 0 top
R15  22.3,43.2 0 top
R16  22.3,41.1 0 top
S1  20.7,33.83 0 bottom
TP1  8.57,63.48 0 top
TP2  10.09,47.78 0 top
TP3  8.71,56.68 0 top
U1  14.9,43.49 90 top
U2  28,31 180 top
U4  6.83,50.61 90 top
U5  41,38 90 top
U$1  3.3,26.7 180 top
U$2  70.8,30.76 180 top
U$3  23.1,60 270 top
U$4  34.24,35.73 90 top
U$5  47.1,53.4 180 top
Y1  12.9,36 0 top

### Tracks (layer width: path | path; a pad name or v marks a point on that pad's centre or on a via)
!EMS  (via drill 0.3)
  Top 0.152: U1.13 19.2,40.67 19.2,38.91 20.19,37.92 20.19,37.69 R3.1 20.19,37.62 20.19,32.47 v18.59,30.86 | J15.2 18.44,29.31 20.73,31.6 24.69,31.6 U2.3 24.77,31.67 27.05,33.96 27.05,52.33 J12.2
  Bottom 0.152: v18.59,30.86 18.59,29.49 J15.2
!RESET  (via drill 0.3)
  Top 0.152: v17.14,32.59 17.14,33.01 C14.2 | v16.38,37.24 16.38,37.54 15.93,38 15.62,38 15.16,38.46 15.16,39.14 U1.7
  Bottom 0.152: v17.14,32.59 17.14,33.81 17.11,33.85 S1.P$2 17.1,33.85 16.61,34.34 16.61,35.48 16.38,35.71 v16.38,37.24
+3V3  (via drill 0.3, 0.35)
  Top 0.152: v12.72,40.74 12.5,40.74 11.2,39.45 11.2,38.84 C9.2 | C13.2 6.1,53.01 5.11,53.01 3.81,54.31 J3.1 4.27,53.77 2.74,52.25 2.74,51.41 3.73,50.42 6.86,50.42 7.7,49.58 U4.2 | 7.77,49.12 U4.2 | 7.77,49.12 7.77,47.68 C11.2 | 7.77,49.12 9.75,49.12 C10.2 9.83,49.12 9.83,48.06 10.06,47.83 TP2.TP 10.13,47.83 12.12,47.83 U1.36 12.19,47.75 12.19,47.07 15.39,43.87 16,43.87 16.04,43.83 | 7.77,49.12 U4.2 | 15.32,42.04 16.18,41.18 16.18,39.22 U1.9 16.15,39.14 16.15,38.22 16.92,37.46 16.92,37.08 C12.2 | U1.48 10.67,40.74 11.51,40.74 12.34,41.58 14.86,41.58 15.32,42.04 | 16.04,43.83 16,43.79 16,42.72 15.32,42.04 | 16.04,43.83 18.59,46.38 18.97,46.38 U1.24 19.13,46.31 18.97,46.46 18.97,47.75 C8.1 18.92,49.82 19.59,50.49 24.45,50.49 25.98,52.02 25.98,58.28 22.97,61.29 U$3.P$2
  Bottom 0.152: v12.72,40.74 12.62,40.84 12.62,44.3 12.76,44.44 | 12.76,44.44 13.41,45.09 13.78,45.09 BOOT0.1 | J3.1 3.81,54.31 3.81,53.7 7.32,50.19 7.32,49.43 C7.1 7.39,49.35 7.39,48.67 11.58,44.48 12.72,44.48 12.76,44.44 | C12.2 18.66,36.47 U2.4
  other vias: 17.53,36.47 24.76,30.36
+5V  (via drill 0.3)
  Top 0.5: U$1.1 5.26,29.47 5.41,29.62 7.16,29.62 C17.2 7.39,29.54 10.13,29.54 10.36,29.31 J15.6 | v17.45,54.08 17.07,54.46 17.07,56.82 J2.A4_B9 | U4.3 6.86,51.56 7.85,52.55 C6.1 8,52.78 8,53.01 9.45,54.46 C5.1 9.53,54.69 9.53,54.91 | 9.53,54.91 9.53,55.91 8.76,56.67 TP3.TP 8.53,56.52 7.7,55.68 2.97,55.68 1.52,54.23 1.52,42.72 J7.4 | 12.19,56.14 12.19,56.82 J2.B4_A9 | 12.19,56.14 10.96,54.91 9.53,54.91 | v12.34,55.83 12.27,55.91 12.19,56.14
  Bottom 0.5: J12.6 19.13,52.4 v17.45,54.08 17.22,54.15 14.02,54.15 v12.34,55.83 | J15.6 10.36,29.31 2.44,37.24 2.44,41.73 1.52,42.65 J7.4
+5V_ISO
  Top 0.5: C3.1 43.43,30.08 43.43,32.06 C4.1 43.43,32.36 43.43,34.19 C19.1 43.36,34.42 43.05,34.72 43.05,36.48 U5.1 42.75,36.48 38.71,36.48 32.74,42.44 32.74,54.88 38.14,60.28 41.74,60.28 F2.2
+12V  (via drill 0.35)
  Top 1: R9.1 53.15,46.42 52.25,45.52 52.25,45.1 C22.1 C16.1 C2.1 45.05,39.9 C18.1 | C18.1 42.65,42.2 U$5.P$2 | U5.3 44.65,39.5 C18.1
  Bottom 1: U5.3 36.98,39.5 | 36.98,39.5 34,42.48 J11.1 | U$4.P$1 34.97,37.49 36.98,39.5
  other vias: 42.98,39.5
BATT_POWER  (2 unrouted)
  Top 0.5: U$2.P$3 70.79,38.3 U$2.30_B | 54.33,54.15 IC5.7 | 53.03,57.35 C23.+ | C24.2 48.3,57.22 48.39,57.39 48.42,57.4
  Top 1.27: 53.03,57.35 56.07,57.35 56.54,56.89 62.12,56.89 J1.2 | C24.2 52.8,57.2 C23.+ 54.38,56.02 54.38,54.15 54.38,54.11
  Bottom 0.5: U$2.30_B 70.79,38.3 U$2.P$3 70.71,38.61
  pour Top (no thermals): 67,52 67,30 75,30 75,52
  pour Bottom (no thermals): 67,52 67,30 75,30 75,52
BATT_POWER_OUT
  Bottom 0.152: U$2.87_T 70.79,20.4 U$2.P$1
  pour Top (no thermals): 10,0 10,11 16,17 38,17 47,26 85,26 85,0
BLUE12  (via drill 0.3)
  Top 0.5: v31.09,37.54 31.09,36.32 IC4.6
  Bottom 0.5: v31.09,37.54 31.09,58.19 28.04,61.24 J11.4
BOOT0  (via drill 0.3)
  Top 0.152: v14.17,43.53 13.44,42.8 10.67,42.8 U1.44
  Bottom 0.152: v14.17,43.53 14.1,43.6 BOOT0.2
CAN_+5V
  Top 0.152: U$1.8 5.26,23.9 5.49,23.67 7.09,23.67 C15.2 7.09,23.75 10.43,27.09 24.62,27.09 30.25,32.72 30.25,37.47 32.26,39.48 32.26,55.34 38.7,61.78 F2.1 41.63,63.02 42.67,63.02 R10.1
CAN_N
  Top 0.152: U$1.5 1.45,23.9 1.45,23.45 3.04,21.86 3.04,17.68 J4.1 2.77,16.91 3.22,16.48 3.22,11.72 2.77,11.34 J5.1 2.82,10.72 2.82,10.41 3.58,9.65 5.5,9.65 10.8,14.96 10.8,17.94 11.23,18.28 J6.1 11.23,24.49 11.3,24.55 11.3,24.78 J13.1 12.42,25.5 12.73,25.2 14.28,25.2 15.03,24.44 18.1,24.44 18.92,23.62 18.92,23.03 19.58,22.38 J14.1 20.79,22.38 21,22.16 25.72,22.16 26.12,21.77 J10.1 27.45,21.88 27.88,22.3 33.64,22.3 J9.1 33.91,22.07 34.14,22.07 35.13,23.06 41.3,23.06 J8.1 41.38,23.14 41.68,23.14 43.51,24.97 43.51,27.79 R12.2
CAN_P
  Top 0.152: U$1.6 2.67,23.9 2.67,22.69 3.36,22 3.36,18.62 4.01,18.3 J4.2 4.01,16.9 3.54,16.42 3.54,11.73 4.01,11.25 J5.2 4.71,10.05 5.46,10.05 10.4,14.99 10.33,17.95 10.14,18.14 10.14,18.74 J6.2 9.98,19.03 9.98,19.18 10.74,19.94 10.74,25.43 J13.2 11.5,25.5 11.5,26.45 11.63,26.58 12.42,26.58 12.55,26.45 12.55,25.8 12.85,25.5 14.4,25.5 15.15,24.75 18.33,24.75 19.48,23.6 20.04,23.6 | R12.1 41.83,27.79 41.83,24.82 41.38,24.36 J8.2 39.88,23.38 33.94,23.38 J9.2 33.6,23.31 32.55,22.69 27.64,22.69 27.32,23.02 J10.2 26.22,23.02 25.77,22.56 21.57,22.56 21.56,22.58 20.04,23.6 | 20.04,23.6 J14.2
CANRX
  Top 0.152: U$1.3 2.67,30.39 2.13,30.92 2.13,36.19 2.29,36.35 2.29,38.58 3.6,39.89 7.38,39.89 9.69,42.19 10.59,42.19 U1.45
CANTX
  Top 0.152: U$1.2 3.89,29.47 3.89,29.62 2.44,31.06 2.44,36.07 2.59,36.22 2.59,38.39 3.78,39.58 7.71,39.58 9.87,41.74 U1.46
CC1
  Top 0.152: R1.2 15.85,55.43 15.85,56.82 J2.A5
CC2
  Top 0.152: R2.1 12.65,53.66 12.65,55.37 12.88,55.6 12.88,56.82 J2.B5
GNDA  (via drill 0.35)
  Top 0.152: U1.47 10.59,41.2 9.83,41.2 8,39.37 8,38.84 v8,38.8
  Bottom 0.152: 26,51.49 27.51,51.49 28.35,52.33 29.03,52.33 J12.1
  other vias: 12,49 6.2,54.7 12,46 11.4,52.1 9.5,38.8 14.1,42.2 16.9,41.3 18.8,33.1 17.5,35 20.2,39.3 24.8,39.7 16,46 23,35 17,50.7 8,36 14.5,40.9 6,47.6 12.5,30.9 14.5,30.9
  pour Top: 0,65 0,27 24,27 26,29 26,52 23,55 23,65
  pour Bottom: 0,65 23,65 23,55 26,52 26,29 24,27 0,27
GNDIO  (via drill 0.35)
  other vias: 48,32 49,37 55,31 59,36 7.1,25.4 30.3,44.8 29,39 30.2,47.1 29,43 33,35 54,51 55,51 56,51 54,52 55,52 56,52 29,41 29,37 33,33 36,29 8,20 6,17 40,38 36,51 36,46 36,42 42,57 48.1,59.7 46,62 49,63 53,63 51,60 57,58 57,63 25,58
  pour Top: 0,26 24,26 27,29 27,52 24,55 24,65 56,65 56,36 38,18 16,18 9,11 9,0 0,0
  pour Bottom (rank 2): 24,65 85,65 85,0 0,0 0,26 24,26 27,29 27,52 24,55
  pour Top (rank 2): 56,65 85,65 85,27 47,27 56,36
  pour Bottom (no thermals): 10,14 10,8 11,9 75,9 75,15 74,14
GREEN12
  Top 0.5: IC2.6 31.17,48.29 31.17,60.48 31.93,61.24 J11.2
LED0
  Top 0.152: R6.1 6.8,35.97 8.83,38 12.19,38 12.65,38.46 12.65,39.14 U1.2
LED1
  Top 0.152: R7.1 6.78,33.66 6.78,34.34 6.02,35.1 6.02,36.4 6.63,37.01 7.39,37.01 8.69,38.3 8.69,39.45 9.53,40.29 11.51,40.29 12.5,41.28 12.95,41.28 13.26,40.97 13.26,39.3 13.18,39.22 U1.3
LED2  (via drill 0.3)
  Top 0.152: v9.05,37.42 9.05,34.47 6.86,32.28 6.86,31.6 R8.1 | v13.79,40.36 13.79,40.06 13.72,39.98 13.72,39.22 U1.4
  Bottom 0.152: v13.79,40.36 13.59,40.16 11.79,40.16 v9.05,37.42
LED12_BLUE  (via drill 0.3)
  Top 0.152: v20.42,42.5 21.41,41.5 21.41,41.12 R16.1 | v17.07,40.36 16.69,39.98 16.69,39.22 U1.10
  Bottom 0.152: v20.42,42.5 18.29,40.36 v17.07,40.36
LED12_GREEN  (via drill 0.3)
  Top 0.152: v20.42,44.4 21.26,45.24 21.41,45.24 R14.1 | v17.98,41.96 17.98,41.66 17.6,41.28 17.6,39.22 U1.12
  Bottom 0.152: v17.98,41.96 v20.42,44.4
LED12_RED  (via drill 0.3)
  Top 0.152: v21.49,42.19 21.49,43.18 R15.1 | v17.3,38 17.3,38.3 17.22,38.38 17.22,39.14 U1.11
  Bottom 0.152: v17.3,38 v21.49,42.19
LED_CAN  (via drill 0.3)
  Top 0.152: v5.64,36.78 5.71,36.78 6.71,37.77 R13.1 | v15.73,44.68 15.73,45.44 15.16,46 15.16,47.75 U1.30
  Bottom 0.152: v5.64,36.78 8,36.78 8.11,36.89 9.3,36.89 9.6,37.19 9.6,37.54 11.89,39.83 14.41,39.83 15.73,41.14 v15.73,44.67 v15.73,44.68
N$1
  Top 0.152: R4.1 34.59,30.76 34.59,34.11 34.9,34.42 U$4.P$2
  Bottom 0.152: U$4.P$2 34.98,34.42 56.69,34.42 62.33,28.78 U$2.P$4
N$2
  Top 0.152: R7.2 3.35,33.66 D2.A
N$3
  Top 0.152: U2.1 31.24,30.38 32.54,30.38 32.84,30.68 R4.2
N$4
  Top 0.152: R9.2 54.86,46.61 56.24,46.61 R11.1 56.24,46.69 56.24,46.92 56.92,47.6 56.92,48.67 IC5.4
N$5
  Top 0.152: R6.2 5.03,35.71 3.81,35.71 3.35,35.26 D1.A
N$6
  Top 0.152: C1.1 51.55,48.59 52.96,48.59 53.03,48.67 IC5.1
N$7
  Top 0.152: C20.2 15.24,33.05 15.24,35.48 14.78,35.94 Y1.2 14.71,36.02 14.71,39.14 U1.6
N$8
  Top 0.152: C21.2 10.59,33.05 10.59,35.48 11.05,35.94 Y1.1 11.12,36.02 13.11,38 13.64,38 14.1,38.46 14.1,39.14 U1.5
N$9
  Top 0.152: D4.A R10.2
N$10
  Top 1: IC5.8 53.09,53.27 52.8,52.97 52.8,51.55 C1.2 51.2,49.95 D6.1 48.8,50.95 46.65,53.1 41.85,53.1 U$5.P$1
N$11
  Top 0.152: R5.1 14.63,51.29 14.63,47.83 U1.31
N$12
  Top 0.152: R13.2 5.03,37.85 3.58,37.85 D5.A
N$14
  Top 0.152: R14.2 23.16,45.31 23.16,46.53 24.84,48.21 IC2.1
N$15
  Top 0.152: R15.2 23.16,43.18 24,43.18 24.84,42.34 IC3.1
N$18
  Top 0.152: R16.2 23.16,41.05 23.16,38 24.84,36.32 IC4.1
N$21
  Top 0.152: R8.2 5.11,31.6 3.89,31.6 3.35,32.13 D3.A
RED12
  Top 0.5: IC3.6 31.09,42.34 31.09,42.87 29.2,44.76 29.2,50.97 30.18,51.94 30.18,61.09 30.02,61.24 J11.3
SPI1_MISO
  Top 0.152: U1.15 19.13,41.73 18.52,41.73 17.91,41.12 17.91,40.13 18.46,39.58 18.46,34.1 17.91,33.54 17.91,32.29 14.93,29.31 14.4,29.31 J15.4
SPI1_MOSI
  Top 0.152: U1.16 19.2,42.19 19.96,42.19 20.65,41.5 20.65,40.29 21.03,39.91 21.03,32.34 18.92,30.23 18.06,30.23 17.3,29.47 17.3,28.93 16.76,28.4 13.26,28.4 12.42,29.24 J15.5
SPI1_SCK
  Top 0.152: J15.3 16.4,29.5 19,32.1 19.36,32.1 19.58,32.32 19.58,36.49 18.9,37.18 18.9,39.6 18.21,40.29 18.21,40.97 18.44,41.2 19.13,41.2 U1.14
SPI2_MISO
  Top 0.152: U1.27 16.69,47.83 16.69,48.52 19.36,51.18 21.95,51.18 23.09,52.33 J12.4
SPI2_MOSI
  Top 0.152: U1.28 16.15,47.83 16.15,48.52 19.13,51.49 20.19,51.49 21.03,52.33 J12.5
SPI2_SCK
  Top 0.152: U1.26 17.22,47.83 17.22,48.59 19.51,50.88 23.62,50.88 25.07,52.33 J12.3
START_IO
  Top 0.152: U1.29 15.7,47.83 15.7,50.41 22.33,57.03 22.33,58.73 U$3.P$1
SWCLK
  Top 0.152: U1.37 10.59,46.31 5.94,46.31 3.81,48.44 3.81,49.28 J3.3
SWDIO
  Top 0.152: U1.34 13.11,47.83 13.11,49.52 12.58,50.04 8.61,50.04 7.85,50.8 4.8,50.8 3.81,51.79 J3.2
USART_RX
  Top 0.152: U1.43 10.48,43.12 9.55,43.12 8.25,41.82 5.13,41.82 4.25,42.7 J7.3
USART_TX
  Top 0.152: U1.42 10.59,43.72 6.55,43.72 5.56,42.72 J7.2
USB_DM
  Top 0.152: J2.A7 14.4,56.9 14.4,57.51 14.63,57.73 15.16,57.73 15.32,57.58 15.32,56.9 J2.B7 15.39,56.28 14.45,55.34 14.45,52.92 14.1,52.57 14.1,47.83 U1.32
USB_DP
  Top 0.152: 14.13,56.1 14.17,56.06 14.63,56.06 14.86,56.29 14.86,56.82 J2.A6 | 14.13,56.1 13.95,56.29 13.95,56.82 J2.B6 | U1.33 13.64,47.83 13.64,50.61 13.17,51.08 R5.2 12.9,51.81 14.1,53.01 14.1,56.06 14.13,56.1

### Text on the board
tNames: Chibaroobo / _master2024 | powered by ykc / zawaza13